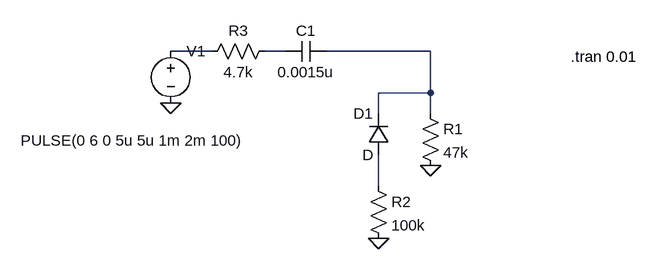
[diagram p0: schematic Draft7.asc]
Draft7.asc, the LTspice schematic file:
Version 4
SHEET 1 880 680
WIRE 112 -256 48 -256
WIRE 224 -256 192 -256
WIRE 448 -256 288 -256
WIRE 448 -192 448 -256
WIRE 448 -192 368 -192
WIRE 368 -160 368 -192
WIRE 448 -160 448 -192
WIRE 368 -48 368 -96
FLAG 368 32 0
FLAG 448 -80 0
FLAG 48 -176 0
SYMBOL Res 352 -64 R0
SYMATTR InstName R2
SYMATTR Value 100k
SYMBOL Diode 384 -96 R180
WINDOW 0 24 64 Left 2
WINDOW 3 24 0 Left 2
SYMATTR InstName D1
SYMBOL Res 432 -176 R0
SYMATTR InstName R1
SYMATTR Value 47k
SYMBOL Cap 288 -272 R90
WINDOW 0 0 32 VBottom 2
WINDOW 3 32 32 VTop 2
SYMATTR InstName C1
SYMATTR Value 0.0015u
SYMBOL Voltage 48 -272 R0
WINDOW 3 -231 153 Left 2
SYMATTR InstName V1
SYMATTR Value PULSE(0 6 0 5u 5u 1m 2m 100)
SYMBOL Res 208 -272 R90
WINDOW 0 0 56 VBottom 2
WINDOW 3 32 56 VTop 2
SYMATTR InstName R3
SYMATTR Value 4.7k
TEXT 664 -248 Left 2 !.tran 0.01

The netlist it stands for:
* Draft7.asc
R2 N004 0 100k
D1 N004 N003 D
R1 N003 0 47k
C1 N003 N002 0.0015u
V1 N001 0 PULSE(0 6 0 5u 5u 1m 2m 100)
R3 N002 N001 4.7k
.model D D
.lib standard.dio
.tran 0.01
.backanno
.end